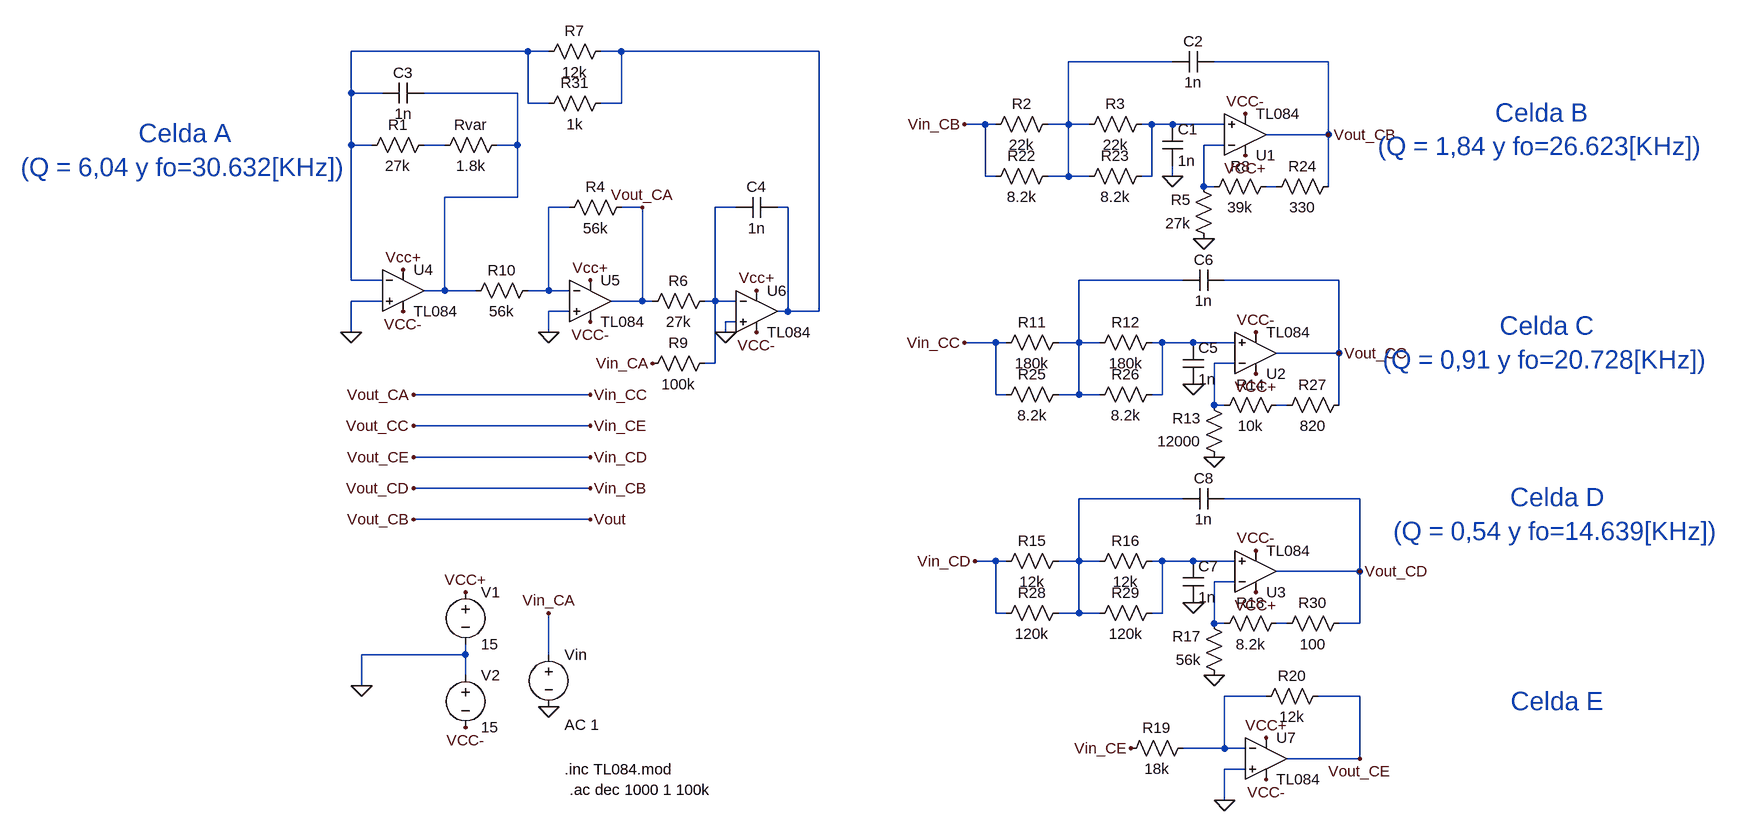
[diagram p0: schematic Placa_Tp1_Sim.asc]
Placa_Tp1_Sim.asc, the LTspice schematic file:
Version 4
SHEET 1 880 1004
WIRE -1136 -416 -1408 -416
WIRE -1104 -416 -1136 -416
WIRE -992 -416 -1024 -416
WIRE -688 -416 -992 -416
WIRE -144 -400 -304 -400
WIRE 96 -400 -80 -400
WIRE -1408 -352 -1408 -416
WIRE -1360 -352 -1408 -352
WIRE -1152 -352 -1296 -352
WIRE -1136 -336 -1136 -416
WIRE -1104 -336 -1136 -336
WIRE -992 -336 -992 -416
WIRE -992 -336 -1024 -336
WIRE -432 -304 -464 -304
WIRE -416 -304 -432 -304
WIRE -304 -304 -304 -400
WIRE -304 -304 -336 -304
WIRE -272 -304 -304 -304
WIRE -176 -304 -192 -304
WIRE -144 -304 -176 -304
WIRE -64 -304 -144 -304
WIRE 96 -288 96 -400
WIRE 96 -288 0 -288
WIRE -1408 -272 -1408 -352
WIRE -1376 -272 -1408 -272
WIRE -1264 -272 -1296 -272
WIRE -1152 -272 -1152 -352
WIRE -1152 -272 -1184 -272
WIRE -64 -272 -96 -272
WIRE -432 -224 -432 -304
WIRE -416 -224 -432 -224
WIRE -304 -224 -304 -304
WIRE -304 -224 -336 -224
WIRE -272 -224 -304 -224
WIRE -176 -224 -176 -304
WIRE -176 -224 -192 -224
WIRE -144 -224 -144 -240
WIRE -96 -208 -96 -272
WIRE -80 -208 -96 -208
WIRE 16 -208 0 -208
WIRE 96 -208 96 -288
WIRE -1152 -192 -1152 -272
WIRE -1152 -192 -1264 -192
WIRE -1072 -176 -1104 -176
WIRE -960 -176 -992 -176
WIRE -816 -176 -848 -176
WIRE -736 -176 -752 -176
WIRE -1408 -64 -1408 -272
WIRE -1360 -64 -1408 -64
WIRE -128 -64 -288 -64
WIRE 112 -64 -64 -64
WIRE -1264 -48 -1264 -192
WIRE -1264 -48 -1296 -48
WIRE -1216 -48 -1264 -48
WIRE -1104 -48 -1104 -176
WIRE -1104 -48 -1136 -48
WIRE -1072 -48 -1104 -48
WIRE -1360 -32 -1408 -32
WIRE -960 -32 -960 -176
WIRE -960 -32 -1008 -32
WIRE -944 -32 -960 -32
WIRE -848 -32 -848 -176
WIRE -848 -32 -864 -32
WIRE -816 -32 -848 -32
WIRE -1072 -16 -1104 -16
WIRE -736 -16 -736 -176
WIRE -736 -16 -752 -16
WIRE -688 -16 -688 -416
WIRE -688 -16 -736 -16
WIRE -816 0 -832 0
WIRE -1408 16 -1408 -32
WIRE -1104 16 -1104 -16
WIRE -832 16 -832 0
WIRE -416 32 -464 32
WIRE -400 32 -416 32
WIRE -288 32 -288 -64
WIRE -288 32 -320 32
WIRE -256 32 -288 32
WIRE -160 32 -176 32
WIRE -112 32 -160 32
WIRE -48 32 -112 32
WIRE 112 48 112 -64
WIRE 112 48 16 48
WIRE -848 64 -848 -32
WIRE -848 64 -864 64
WIRE -48 64 -80 64
WIRE -1040 112 -1312 112
WIRE -416 112 -416 32
WIRE -400 112 -416 112
WIRE -288 112 -288 32
WIRE -288 112 -320 112
WIRE -256 112 -288 112
WIRE -160 112 -160 32
WIRE -160 112 -176 112
WIRE -80 128 -80 64
WIRE -64 128 -80 128
WIRE 32 128 16 128
WIRE 112 128 112 48
WIRE -1040 160 -1312 160
WIRE -1040 208 -1312 208
WIRE -1040 256 -1312 256
WIRE -128 272 -288 272
WIRE 144 272 -64 272
WIRE -1040 304 -1312 304
WIRE -416 368 -448 368
WIRE -400 368 -416 368
WIRE -288 368 -288 272
WIRE -288 368 -320 368
WIRE -256 368 -288 368
WIRE -160 368 -176 368
WIRE -112 368 -160 368
WIRE -48 368 -112 368
WIRE 144 384 144 272
WIRE 144 384 16 384
WIRE -48 400 -80 400
WIRE -416 448 -416 368
WIRE -400 448 -416 448
WIRE -288 448 -288 368
WIRE -288 448 -320 448
WIRE -256 448 -288 448
WIRE -160 448 -160 368
WIRE -160 448 -176 448
WIRE -80 464 -80 400
WIRE -64 464 -80 464
WIRE 32 464 16 464
WIRE 144 464 144 384
WIRE 144 464 112 464
WIRE -1232 512 -1232 496
WIRE -1232 512 -1392 512
WIRE -1104 512 -1104 448
WIRE -1232 544 -1232 512
WIRE -1392 560 -1392 512
WIRE 0 576 -64 576
WIRE 144 576 80 576
WIRE -64 656 -64 576
WIRE -64 656 -128 656
WIRE -32 656 -64 656
WIRE 144 672 144 576
WIRE 144 672 32 672
WIRE -32 688 -64 688
WIRE -64 736 -64 688
FLAG -1408 16 0
FLAG -1104 16 0
FLAG -832 16 0
FLAG -784 -48 Vcc+
FLAG -1040 -64 Vcc+
FLAG -1328 -80 Vcc+
FLAG -784 16 VCC-
FLAG -1040 0 VCC-
FLAG -1328 -16 VCC-
FLAG -944 64 Vin_CA
FLAG -960 -176 Vout_CA
FLAG -1104 592 0
FLAG -32 -256 VCC+
FLAG -32 -320 VCC-
FLAG -144 -224 0
FLAG -96 -128 0
FLAG -464 -304 Vin_CB
FLAG 96 -288 Vout_CB
FLAG -16 80 VCC+
FLAG -16 16 VCC-
FLAG -112 96 0
FLAG -80 208 0
FLAG -464 32 Vin_CC
FLAG 112 48 Vout_CC
FLAG -16 416 VCC+
FLAG -16 352 VCC-
FLAG -112 432 0
FLAG -80 544 0
FLAG -448 368 Vin_CD
FLAG 144 384 Vout_CD
FLAG 0 640 VCC+
FLAG 0 704 VCC-
FLAG -64 736 0
FLAG -208 656 Vin_CE
FLAG 144 672 Vout_CE
FLAG -1392 560 0
FLAG -1232 416 VCC+
FLAG -1232 624 VCC-
FLAG -1040 304 Vout
FLAG -1312 304 Vout_CB
FLAG -1040 256 Vin_CB
FLAG -1312 256 Vout_CD
FLAG -1040 160 Vin_CE
FLAG -1312 160 Vout_CC
FLAG -1040 208 Vin_CD
FLAG -1312 208 Vout_CE
FLAG -1040 112 Vin_CC
FLAG -1312 112 Vout_CA
FLAG -1104 448 Vin_CA
SYMBOL Opamps\\opamp2 -1328 -112 R0
SYMATTR InstName U4
SYMATTR Value TL084
SYMBOL Opamps\\opamp2 -1040 -96 R0
SYMATTR InstName U5
SYMATTR Value TL084
SYMBOL Opamps\\opamp2 -784 -80 R0
SYMATTR InstName U6
SYMATTR Value TL084
SYMBOL cap -1296 -368 R90
WINDOW 0 0 32 VBottom 2
WINDOW 3 32 32 VTop 2
SYMATTR InstName C3
SYMATTR Value 1n
SYMBOL res -976 -192 R90
WINDOW 0 0 56 VBottom 2
WINDOW 3 32 56 VTop 2
SYMATTR InstName R4
SYMATTR Value 56k
SYMBOL res -848 -48 R90
WINDOW 0 0 56 VBottom 2
WINDOW 3 32 56 VTop 2
SYMATTR InstName R6
SYMATTR Value 27k
SYMBOL cap -752 -192 R90
WINDOW 0 0 32 VBottom 2
WINDOW 3 32 32 VTop 2
SYMATTR InstName C4
SYMATTR Value 1n
SYMBOL res -1008 -432 R90
WINDOW 0 0 56 VBottom 2
WINDOW 3 32 56 VTop 2
SYMATTR InstName R7
SYMATTR Value 12k
SYMBOL res -848 48 R90
WINDOW 0 0 56 VBottom 2
WINDOW 3 32 56 VTop 2
SYMATTR InstName R9
SYMATTR Value 100k
SYMBOL res -1120 -64 R90
WINDOW 0 0 56 VBottom 2
WINDOW 3 32 56 VTop 2
SYMATTR InstName R10
SYMATTR Value 56k
SYMBOL voltage -1104 496 R0
WINDOW 123 24 124 Left 2
WINDOW 39 0 0 Left 2
SYMATTR Value2 AC 1
SYMATTR InstName Vin
SYMATTR Value ""
SYMBOL res -320 -320 R90
WINDOW 0 0 56 VBottom 2
WINDOW 3 32 56 VTop 2
SYMATTR InstName R2
SYMATTR Value 22k
SYMBOL res -176 -320 R90
WINDOW 0 0 56 VBottom 2
WINDOW 3 32 56 VTop 2
SYMATTR InstName R3
SYMATTR Value 22k
SYMBOL res -80 -112 R180
WINDOW 0 36 76 Left 2
WINDOW 3 36 40 Left 2
SYMATTR InstName R5
SYMATTR Value 27k
SYMBOL res -96 -192 R270
WINDOW 0 32 56 VTop 2
WINDOW 3 0 56 VBottom 2
SYMATTR InstName R8
SYMATTR Value 39k
SYMBOL Opamps\\opamp2 -32 -224 M180
SYMATTR InstName U1
SYMATTR Value TL084
SYMBOL cap -160 -304 R0
SYMATTR InstName C1
SYMATTR Value 1n
SYMBOL cap -80 -416 R90
WINDOW 0 0 32 VBottom 2
WINDOW 3 32 32 VTop 2
SYMATTR InstName C2
SYMATTR Value 1n
SYMBOL res -304 16 R90
WINDOW 0 0 56 VBottom 2
WINDOW 3 32 56 VTop 2
SYMATTR InstName R11
SYMATTR Value 180k
SYMBOL res -160 16 R90
WINDOW 0 0 56 VBottom 2
WINDOW 3 32 56 VTop 2
SYMATTR InstName R12
SYMATTR Value 180k
SYMBOL res -64 224 R180
WINDOW 0 36 76 Left 2
WINDOW 3 36 40 Left 2
SYMATTR InstName R13
SYMATTR Value 12000
SYMBOL res -80 144 R270
WINDOW 0 32 56 VTop 2
WINDOW 3 0 56 VBottom 2
SYMATTR InstName R14
SYMATTR Value 10k
SYMBOL Opamps\\opamp2 -16 112 M180
SYMATTR InstName U2
SYMATTR Value TL084
SYMBOL cap -128 32 R0
SYMATTR InstName C5
SYMATTR Value 1n
SYMBOL cap -64 -80 R90
WINDOW 0 0 32 VBottom 2
WINDOW 3 32 32 VTop 2
SYMATTR InstName C6
SYMATTR Value 1n
SYMBOL res -304 352 R90
WINDOW 0 0 56 VBottom 2
WINDOW 3 32 56 VTop 2
SYMATTR InstName R15
SYMATTR Value 12k
SYMBOL res -160 352 R90
WINDOW 0 0 56 VBottom 2
WINDOW 3 32 56 VTop 2
SYMATTR InstName R16
SYMATTR Value 12k
SYMBOL res -64 560 R180
WINDOW 0 36 76 Left 2
WINDOW 3 36 40 Left 2
SYMATTR InstName R17
SYMATTR Value 56k
SYMBOL res -80 480 R270
WINDOW 0 32 56 VTop 2
WINDOW 3 0 56 VBottom 2
SYMATTR InstName R18
SYMATTR Value 8.2k
SYMBOL Opamps\\opamp2 -16 448 M180
SYMATTR InstName U3
SYMATTR Value TL084
SYMBOL cap -128 368 R0
SYMATTR InstName C7
SYMATTR Value 1n
SYMBOL cap -64 256 R90
WINDOW 0 0 32 VBottom 2
WINDOW 3 32 32 VTop 2
SYMATTR InstName C8
SYMATTR Value 1n
SYMBOL Opamps\\opamp2 0 608 R0
SYMATTR InstName U7
SYMATTR Value TL084
SYMBOL res -112 640 R90
WINDOW 0 0 56 VBottom 2
WINDOW 3 32 56 VTop 2
SYMATTR InstName R19
SYMATTR Value 18k
SYMBOL res 96 560 R90
WINDOW 0 0 56 VBottom 2
WINDOW 3 32 56 VTop 2
SYMATTR InstName R20
SYMATTR Value 12k
SYMBOL voltage -1232 400 R0
WINDOW 123 0 0 Left 0
WINDOW 39 0 0 Left 0
SYMATTR InstName V1
SYMATTR Value 15
SYMBOL voltage -1232 528 R0
WINDOW 123 0 0 Left 0
WINDOW 39 0 0 Left 0
SYMATTR InstName V2
SYMATTR Value 15
SYMBOL res -1280 -288 R90
WINDOW 0 0 56 VBottom 2
WINDOW 3 32 56 VTop 2
SYMATTR InstName R1
SYMATTR Value 27k
SYMBOL res -1168 -288 R90
WINDOW 0 0 56 VBottom 2
WINDOW 3 32 56 VTop 2
SYMATTR InstName Rvar
SYMATTR Value 1.8k
SYMBOL res -320 -240 R90
WINDOW 0 0 56 VBottom 2
WINDOW 3 32 56 VTop 2
SYMATTR InstName R22
SYMATTR Value 8.2k
SYMBOL res -176 -240 R90
WINDOW 0 0 56 VBottom 2
WINDOW 3 32 56 VTop 2
SYMATTR InstName R23
SYMATTR Value 8.2k
SYMBOL res 112 -224 R90
WINDOW 0 0 56 VBottom 2
WINDOW 3 32 56 VTop 2
SYMATTR InstName R24
SYMATTR Value 330
SYMBOL res -304 96 R90
WINDOW 0 0 56 VBottom 2
WINDOW 3 32 56 VTop 2
SYMATTR InstName R25
SYMATTR Value 8.2k
SYMBOL res -160 96 R90
WINDOW 0 0 56 VBottom 2
WINDOW 3 32 56 VTop 2
SYMATTR InstName R26
SYMATTR Value 8.2k
SYMBOL res 128 112 R90
WINDOW 0 0 56 VBottom 2
WINDOW 3 32 56 VTop 2
SYMATTR InstName R27
SYMATTR Value 820
SYMBOL res -304 432 R90
WINDOW 0 0 56 VBottom 2
WINDOW 3 32 56 VTop 2
SYMATTR InstName R28
SYMATTR Value 120k
SYMBOL res -160 432 R90
WINDOW 0 0 56 VBottom 2
WINDOW 3 32 56 VTop 2
SYMATTR InstName R29
SYMATTR Value 120k
SYMBOL res 128 448 R90
WINDOW 0 0 56 VBottom 2
WINDOW 3 32 56 VTop 2
SYMATTR InstName R30
SYMATTR Value 100
SYMBOL res -1008 -352 R90
WINDOW 0 0 56 VBottom 2
WINDOW 3 32 56 VTop 2
SYMATTR InstName R31
SYMATTR Value 1k
TEXT -1080 688 Left 2 !.inc TL084.mod
TEXT -1072 720 Left 2 !.ac dec 1000 1 100k
TEXT -1664 -264 Center 4 ;Celda A\n(Q = 6,04 y fo=30.632[KHz])
TEXT 424 -296 Center 4 ;Celda B\n(Q = 1,84 y fo=26.623[KHz])
TEXT 432 32 Center 4 ;Celda C\n(Q = 0,91 y fo=20.728[KHz])
TEXT 448 296 Center 4 ;Celda D\n(Q = 0,54 y fo=14.639[KHz])
TEXT 448 584 Center 4 ;Celda E

The netlist it stands for:
* Placa_Tp1_Sim.asc
XU4 0 N001 Vcc+ VCC- N004 TL084  ; pins In+ In- V+ V- OUT
XU5 0 N009 Vcc+ VCC- Vin_CC TL084  ; pins In+ In- V+ V- OUT
XU6 0 N010 Vcc+ VCC- N002 TL084  ; pins In+ In- V+ V- OUT
C3 N004 N001 1n
R4 Vin_CC N009 56k
R6 N010 Vin_CC 27k
C4 N002 N010 1n
R7 N002 N001 12k
R9 N010 Vin_CA 100k
R10 N009 N004 56k
Vin Vin_CA 0 AC 1
R2 N003 Vout_CD 22k
R3 N005 N003 22k
R5 0 N007 27k
R8 N007 N008 39k
XU1 N005 N007 Vcc+ VCC- Vout TL084  ; pins In+ In- V+ V- OUT
C1 N005 0 1n
C2 Vout N003 1n
R11 N011 Vin_CC 180k
R12 N012 N011 180k
R13 0 N013 12000
R14 N013 N014 10k
XU2 N012 N013 Vcc+ VCC- Vin_CE TL084  ; pins In+ In- V+ V- OUT
C5 N012 0 1n
C6 Vin_CE N011 1n
R15 N015 Vout_CE 12k
R16 N016 N015 12k
R17 0 N017 56k
R18 N017 N018 8.2k
XU3 N016 N017 Vcc+ VCC- Vout_CD TL084  ; pins In+ In- V+ V- OUT
C7 N016 0 1n
C8 Vout_CD N015 1n
XU7 0 N019 Vcc+ VCC- Vout_CE TL084  ; pins In+ In- V+ V- OUT
R19 N019 Vin_CE 18k
R20 Vout_CE N019 12k
V1 Vcc+ 0 15
V2 0 VCC- 15
R1 N006 N001 27k
Rvar N004 N006 1.8k
R22 N003 Vout_CD 8.2k
R23 N005 N003 8.2k
R24 Vout N008 330
R25 N011 Vin_CC 8.2k
R26 N012 N011 8.2k
R27 Vin_CE N014 820
R28 N015 Vout_CE 120k
R29 N016 N015 120k
R30 Vout_CD N018 100
R31 N002 N001 1k
.inc TL084.mod
.ac dec 1000 1 100k
* Celda A
* (Q = 6,04 y fo=30.632[KHz])
* Celda B
* (Q = 1,84 y fo=26.623[KHz])
* Celda C
* (Q = 0,91 y fo=20.728[KHz])
* Celda D
* (Q = 0,54 y fo=14.639[KHz])
* Celda E
.backanno
.end